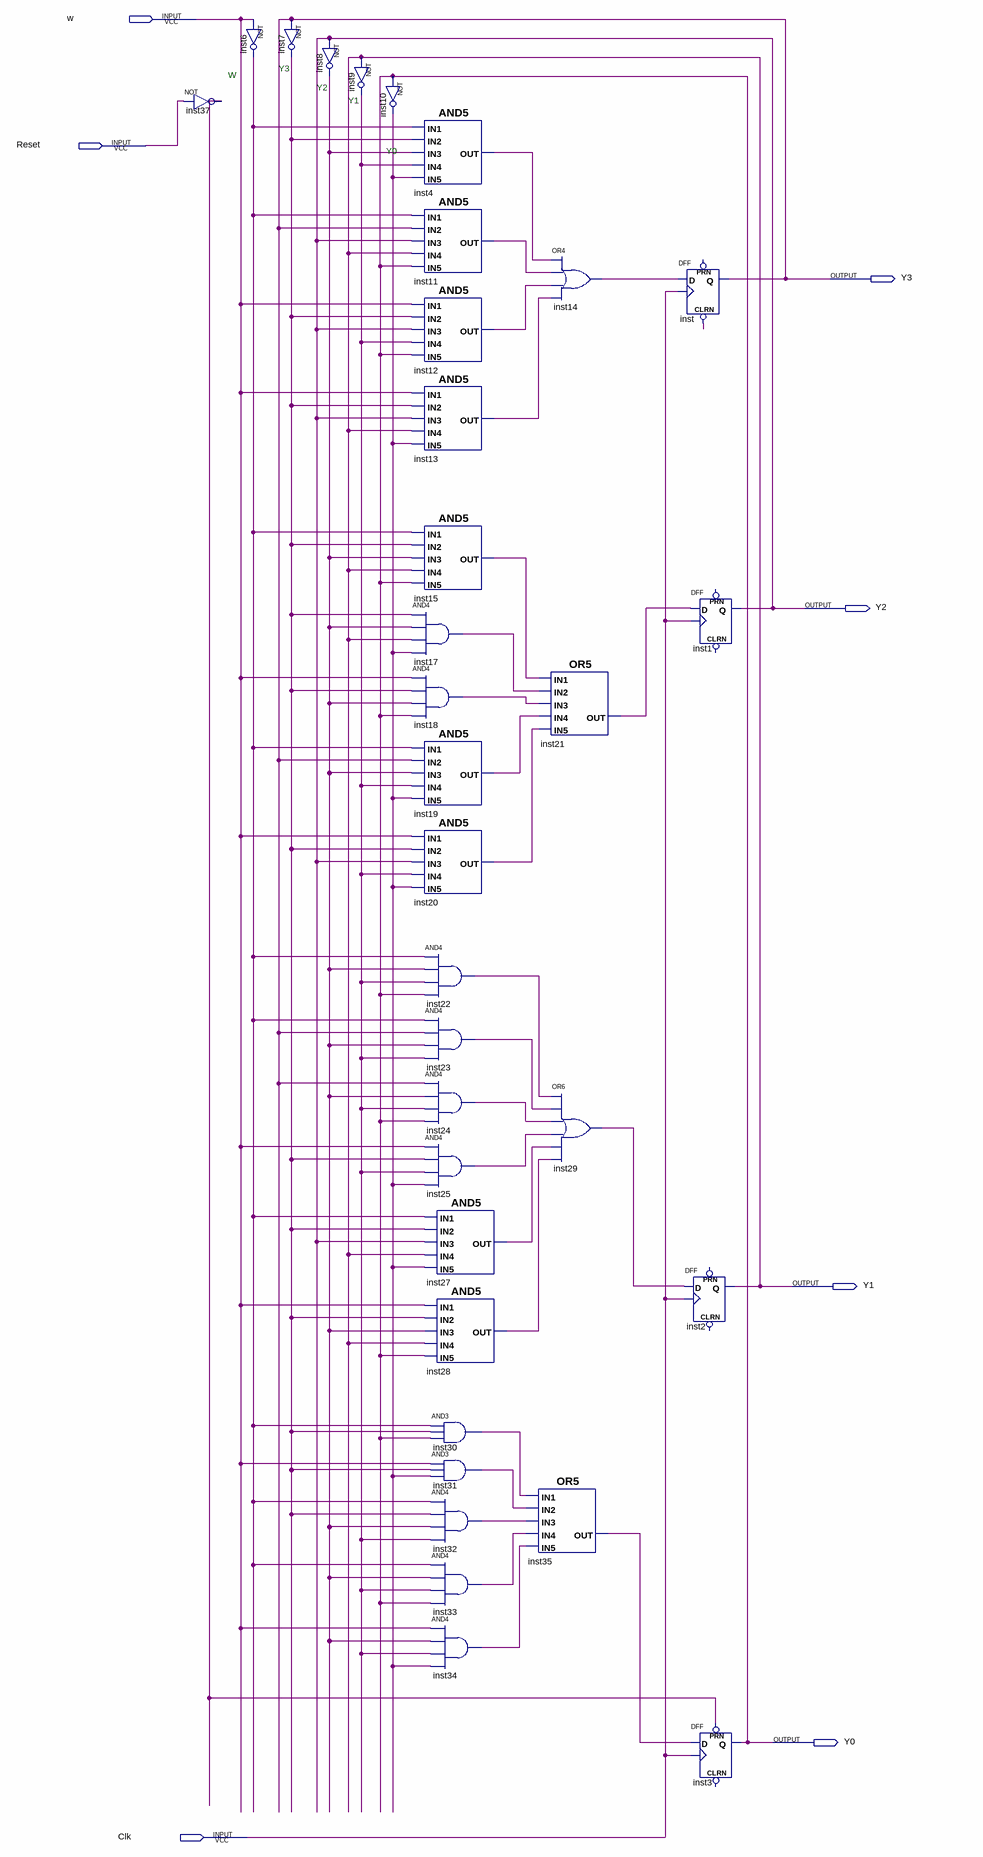
[diagram p0: schematic sheet]
// Quartus schematic randomizer.bdf as structural Verilog: 34 symbols, 7 pins
module randomizer (
  input  w,
  input  Reset,
  input  Clk,
  output Y3,
  output Y2,
  output Y1,
  output Y0
);

  wire inst4_out, inst6_out, inst7_out, inst8_out, inst9_out, inst10_out, inst11_out, inst12_out, inst13_out,
       inst14_out, inst15_out, inst17_out, inst18_out, inst19_out, inst20_out, inst21_out, inst22_out,
       inst23_out, inst24_out, inst25_out, inst27_out, inst28_out, inst29_out, inst30_out, inst31_out,
       inst32_out, inst33_out, inst34_out, inst35_out, inst37_out, undriven;

  not inst37 (inst37_out, Reset);
  not inst6 (inst6_out, w);
  not inst7 (inst7_out, Y3);
  not inst8 (inst8_out, Y2);
  not inst9 (inst9_out, Y1);
  not inst10 (inst10_out, Y0);
  and inst4 (inst4_out, inst6_out, inst7_out, inst8_out, inst9_out, inst10_out);
  and inst11 (inst11_out, inst6_out, Y3, Y2, Y1, Y0);
  and inst12 (inst12_out, w, inst7_out, Y2, inst9_out, Y0);
  and inst13 (inst13_out, w, inst7_out, Y2, Y1, inst10_out);
  and inst15 (inst15_out, inst6_out, inst7_out, inst8_out, Y1, Y0);
  and inst17 (inst17_out, inst7_out, inst8_out, Y1, inst10_out);
  and inst18 (inst18_out, w, inst7_out, inst8_out, Y0);
  and inst19 (inst19_out, inst6_out, Y3, inst8_out, inst9_out, inst10_out);
  and inst20 (inst20_out, w, inst7_out, Y2, inst9_out, inst10_out);
  and inst22 (inst22_out, inst6_out, inst8_out, inst9_out, Y0);
  and inst23 (inst23_out, inst6_out, Y3, inst8_out, inst9_out);
  and inst24 (inst24_out, Y3, inst8_out, inst9_out, Y0);
  and inst25 (inst25_out, w, inst7_out, inst9_out, inst10_out);
  and inst27 (inst27_out, inst6_out, inst7_out, Y2, Y1, inst10_out);
  and inst28 (inst28_out, w, inst7_out, inst8_out, Y1, Y0);
  and inst30 (inst30_out, inst6_out, inst7_out, Y0);
  and inst31 (inst31_out, w, inst7_out, inst10_out);
  and inst32 (inst32_out, inst6_out, inst7_out, inst8_out, inst9_out);
  and inst33 (inst33_out, inst6_out, inst8_out, inst9_out, Y0);
  and inst34 (inst34_out, w, inst8_out, inst9_out, inst10_out);
  or inst35 (inst35_out, inst30_out, inst31_out, inst32_out, inst33_out, inst34_out);
  or inst14 (inst14_out, inst4_out, inst11_out, inst12_out, inst13_out);
  or inst21 (inst21_out, inst15_out, inst17_out, inst18_out, inst19_out, inst20_out);
  or inst29 (inst29_out, inst22_out, inst23_out, inst24_out, inst25_out, inst27_out, inst28_out);
  DFF inst (.CLRN(undriven), .CLK(Clk), .D(inst14_out), .Q(Y3));  // open: PRN
  DFF inst1 (.CLK(Clk), .D(inst21_out), .Q(Y2));  // open: CLRN, PRN
  DFF inst2 (.CLK(Clk), .D(inst29_out), .Q(Y1));  // open: CLRN, PRN
  DFF inst3 (.CLK(Clk), .D(inst35_out), .PRN(inst37_out), .Q(Y0));  // open: CLRN

  // Notes on the sheet:
  //   Y3
  //   W
  //   Y2
  //   Y1
  //   Y0
endmodule
